# Altium schematic sheet synch_demod.SchDoc: Force Stage
size Tabloid; DocumentNumber: LM-002; Revision: F; SheetNumber: 1; SheetTotal: 2; DocumentName: LM-002; ProjectName: LM-002
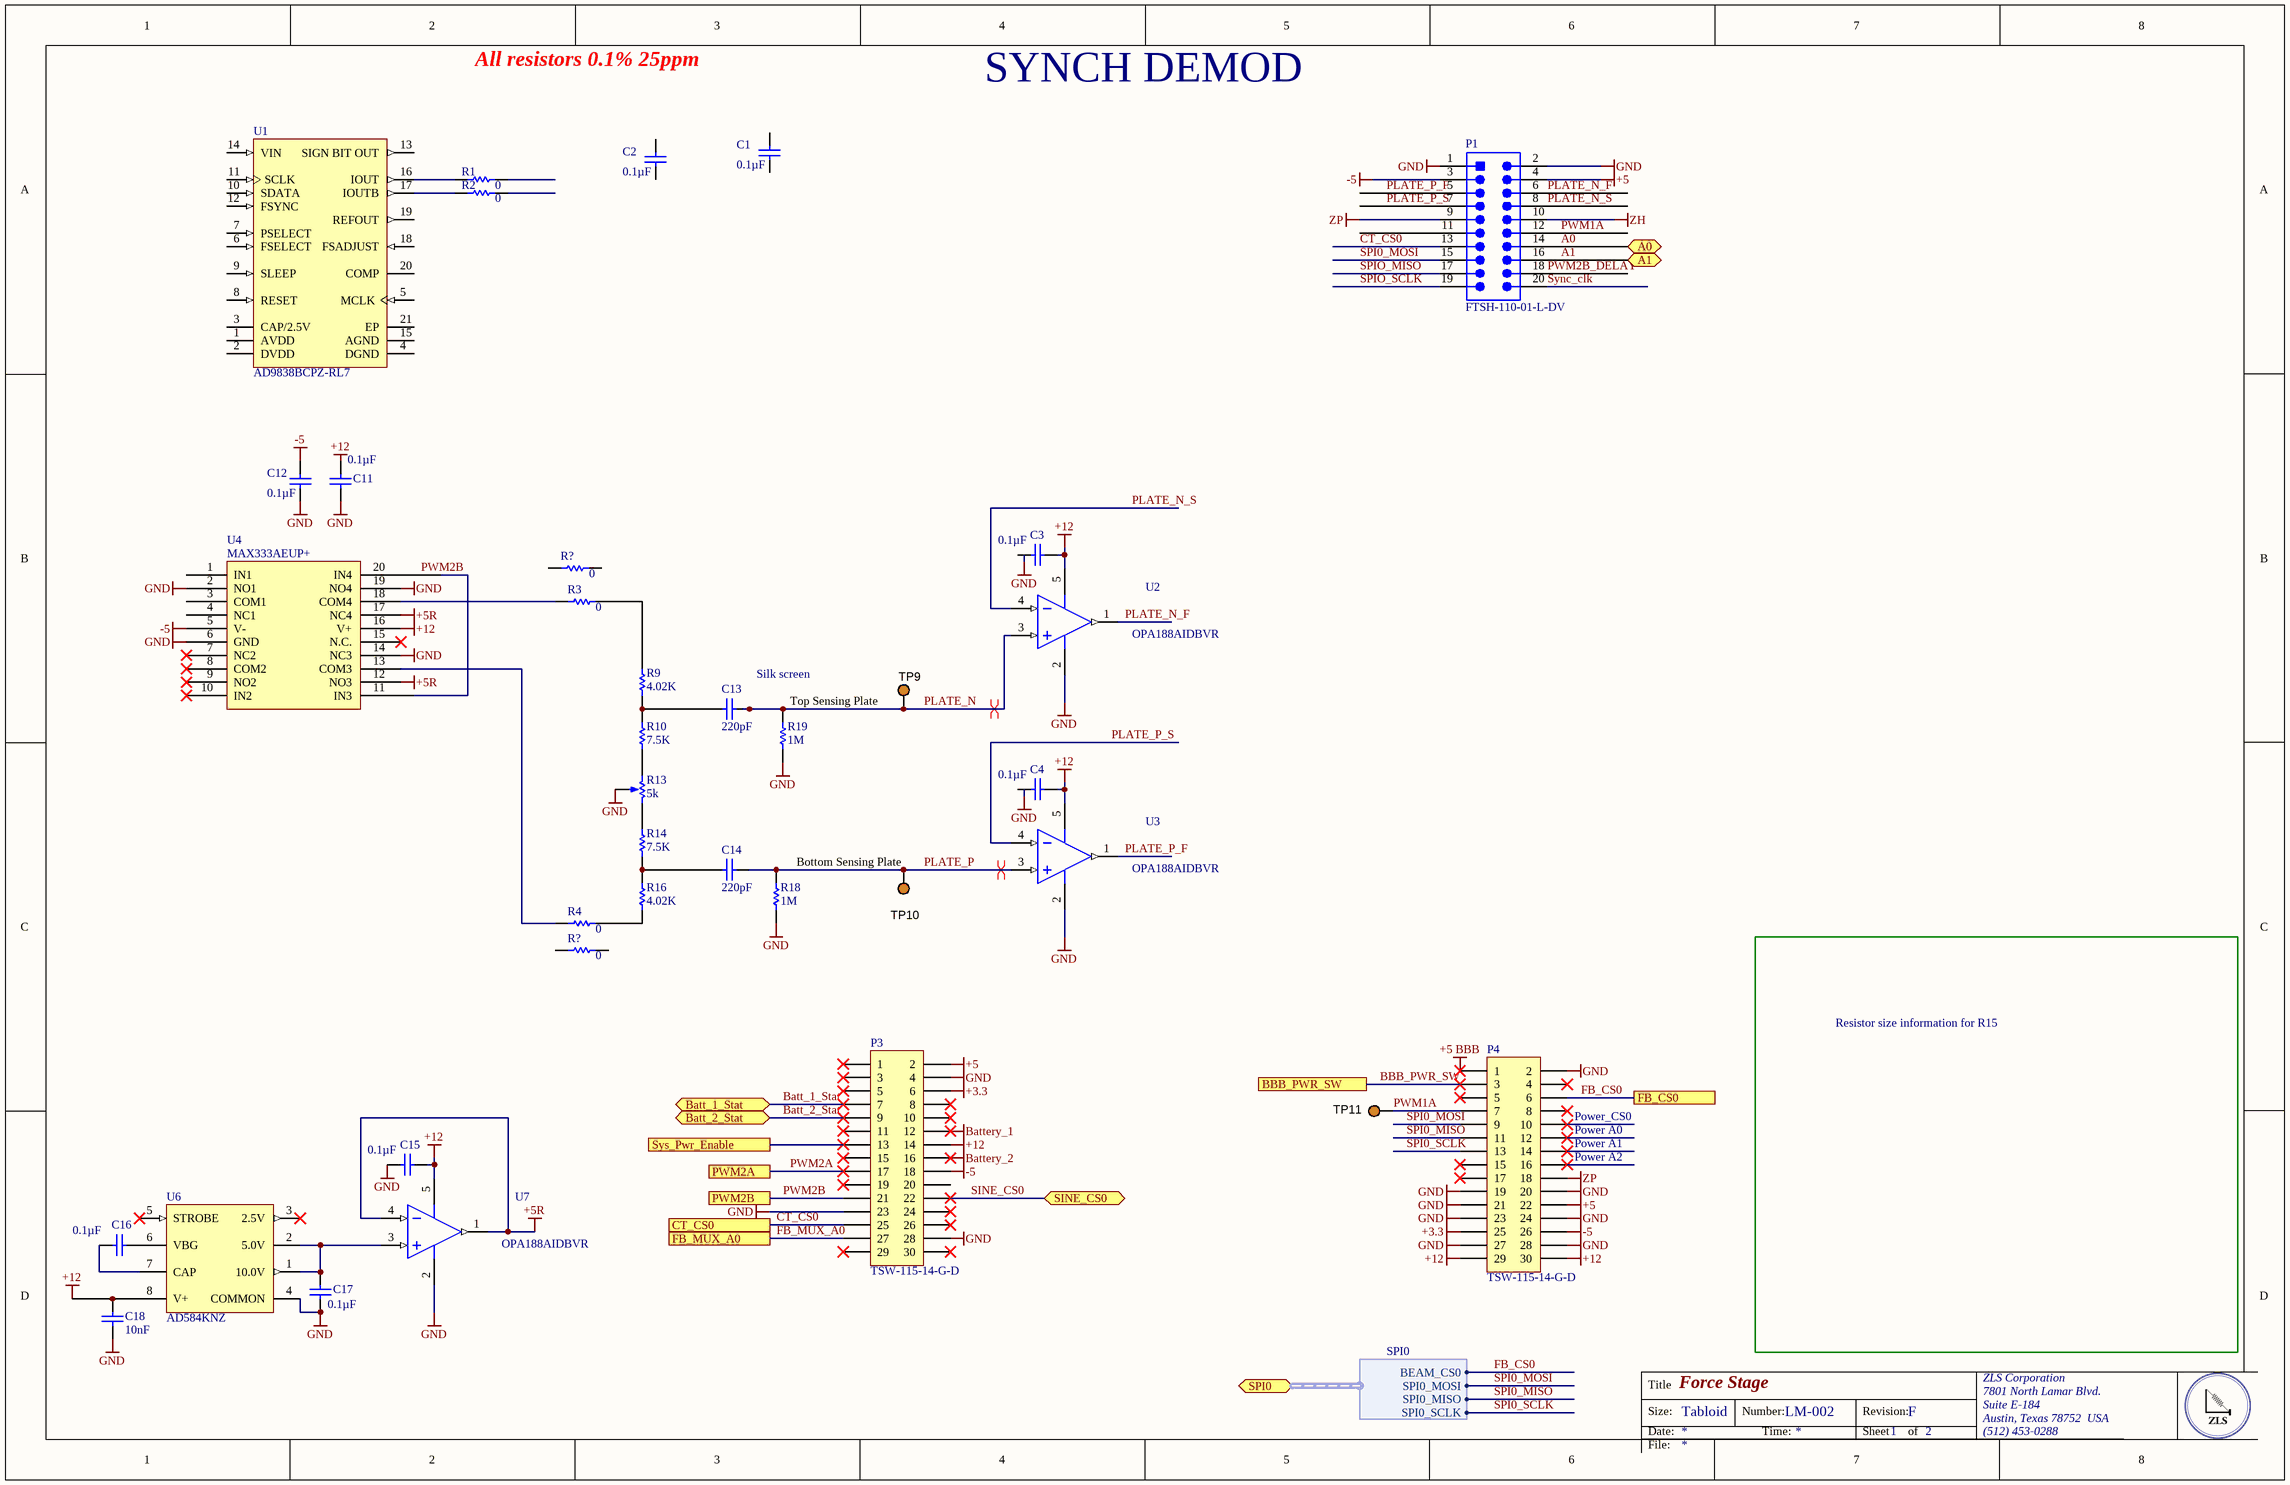
[diagram p0: synch_demod.SchDoc]

## Parts
(Parts that share a designator on the sheet are numbered #1, #2 ... from top to bottom, then left to right.)
C1  Capacitance: 0.1µF  [CAPC0805(2012)145_N]  (hidden comment: CAP CER 0.1UF 25V X7R 0805)
C2  Capacitance: 0.1µF  [CAPC0805(2012)145_N]  (hidden comment: CAP CER 0.1UF 25V X7R 0805)
C3  Capacitance: 0.1µF  [CAPC0805(2012)145_N]  (hidden comment: CAP CER 0.1UF 25V X7R 0805)
C4  Capacitance: 0.1µF  [CAPC0805(2012)145_N]  (hidden comment: CAP CER 0.1UF 25V X7R 0805)
C11  Capacitance: 0.1µF  [CAPC0805(2012)145_N]  (hidden comment: CAP CER 0.1UF 25V X7R 0805)
C12  Capacitance: 0.1µF  [CAPC0805(2012)145_N]  (hidden comment: CAP CER 0.1UF 25V X7R 0805)
C13  Capacitance: 220pF  [CAPC0805(2012)155_L]  (hidden comment: CAP CER 1UF 25V X7R 0805)
C14  Capacitance: 220pF  [CAPC0805(2012)155_L]  (hidden comment: CAP CER 1UF 25V X7R 0805)
C15  Capacitance: 0.1µF  [CAPC0805(2012)145_N]  (hidden comment: CAP CER 0.1UF 25V X7R 0805)
C16  Capacitance: 0.1µF  [CAPC0805(2012)145_N]  (hidden comment: CAP CER 0.1UF 25V X7R 0805)
C17  Capacitance: 0.1µF  [CAPC0805(2012)145_N]  (hidden comment: CAP CER 0.1UF 25V X7R 0805)
C18  Capacitance: 10nF  [CAPC0805(2012)145_N]  (hidden comment: Multilayer Ceramic Capacitors MLCC - SMD/SMT 0.01uF 50volts 10% X7R)
P1  FTSH-110-01-L-DV  [SMTC-FTSH-110-01-L-DV_V]
P3  TSW-115-14-G-D  [TSW-115-14-G-D]
P4  TSW-115-14-G-D  [TSW-115-14-G-D]
R1  0  [RESC0805(2012)_L]
R2  0  [RESC0805(2012)_L]
R3  0  [RESC0805(2012)_L]
R4  0  [RESC0805(2012)_L]
R9  4.02K  [RESC0805(2012)_L]
R10  7.5K  [RESC0805(2012)_L]
R13  Resistance (Ohms): 5k  [Trimmer 2.54]  (hidden comment: TRIMMER 5K OHM 0.25W PC PIN)
R14  7.5K  [RESC0805(2012)_L]
R16  4.02K  [RESC0805(2012)_L]
R18  1M  [RESC0805(2012)_L]
R19  1M  [RESC0805(2012)_L]
R?#1  0  [RESC0805(2012)_L]
R?#2  0  [RESC0805(2012)_L]
TP9  5003  [KSTN-5003]  (value not drawn)
TP10  5003  [KSTN-5003]  (value not drawn)
TP11  5003  [KSTN-5003]  (value not drawn)
U1  AD9838BCPZ-RL7  [ADI-CP-20-10_M]
U2  OPA188AIDBVR  [DBV0005A_M]
U3  OPA188AIDBVR  [DBV0005A_M]
U4  MAX333AEUP+  [TSOP65P640X90-20N]
U6  AD584KNZ  [ADI-N-8]
U7  OPA188AIDBVR  [DBV0005A_M]

## Ports
A0, A1, Batt_1_Stat, Batt_2_Stat, BBB_PWR_SW, CT_CS0, FB_CS0, FB_MUX_A0, PWM2A, PWM2B, SINE_CS0, SPI0 (harness SPI0), Sys_Pwr_Enable

## Harnesses
SPI0: BEAM_CS0, SPI0_MOSI, SPI0_MISO, SPI0_SCLK

## Nets
+3.3: P3.6 P4.25
+5: P1.4 P3.2 P4.22
+5 BBB: P4.1
+5R: U4.12(NO3) U4.17(NC4) U7.1(OUT) U7.4(IN-)
+12: C3.2 C4.2 C15.2 C18.1 P3.14 P4.29 P4.30 U2.5(V+) U3.5(V+) U4.16(V+) U6.8(V+) U7.5(V+)
-5: C12.1 P1.3 P3.18 P4.26 U4.5(V-)
Battery_1: P3.12
Battery_2: P3.16
GND: C11.2 C12.2 C15.1 C17.2 C18.2 P1.1 P1.2 P3.4 P3.23 P3.28 P4.2 P4.19 P4.20 P4.21 P4.23 P4.24 P4.27 P4.28 R13.2(b) R18.1 R19.1 U2.2(V-) U3.2(V-) U4.2(NO1) U4.6(GND) U4.14(NC3) U4.19(NO4) U6.4(COMMON) U7.2(V-)
ZH: P1.10
ZP: P1.9 P4.18
A0: P1.14 ; port A0
A1: P1.16 ; port A1
Batt_1_Stat: P3.7 ; port Batt_1_Stat
Batt_2_Stat: P3.9 ; port Batt_2_Stat
BBB_PWR_SW: P4.3 ; port BBB_PWR_SW
CT_CS0: P1.13 P3.25 ; port CT_CS0
FB_CS0: P4.6 ; port FB_CS0, port SPI0.BEAM_CS0
FB_MUX_A0: P3.27 ; port FB_MUX_A0
PLATE_N: C13.1 R19.2 TP9.1 U2.3(IN+)
PLATE_N_F: P1.6 U2.1(OUT)
PLATE_N_S: P1.8 U2.4(IN-)
PLATE_P: C14.2 R18.2 TP10.1 U3.3(IN+)
PLATE_P_F: P1.5 U3.1(OUT)
PLATE_P_S: P1.7 U3.4(IN-)
PWM1A: P1.12 P4.7 TP11.1
PWM2A: P3.17 ; port PWM2A
PWM2B: P3.21 U4.11(IN3) U4.20(IN4) ; port PWM2B
PWM2B_DELAY: P1.18
SINE_CS0: P3.22 ; port SINE_CS0
SPI0_MISO: P4.11 ; port SPI0.SPI0_MISO
SPI0_MOSI: P1.15 P4.9 ; port SPI0.SPI0_MOSI
SPI0_SCLK: P4.13 ; port SPI0.SPI0_SCLK
SPIO_MISO: P1.17
SPIO_SCLK: P1.19
Sync_clk: P1.20
Sys_Pwr_Enable: P3.13 ; port Sys_Pwr_Enable
NetC13_2: C13.2 R9.1 R10.2
NetC14_1: C14.1 R14.1 R16.2
NetC16_1: C16.1 U6.7(CAP)
NetC16_2: C16.2 U6.6(VBG)
NetC17_1: C17.1 U6.1(10.0V) U6.2(5.0V) U7.3(IN+)
NetR1_2: R1.2 U1.16(IOUT)
NetR2_2: R2.2 U1.17(IOUTB)
NetR3_1: R3.1 R9.2
NetR3_2: R3.2 U4.18(COM4)
NetR4_1: R4.1 R16.1
NetR4_2: R4.2 U4.13(COM3)
NetR10_1: R10.1 R13.1(a)
NetR13_3: R13.3(c) R14.2

Not connected (* = marked no-connect by the designer): C1 1 2; C2 1 2; C3 1; C4 1; C11 1; P1 11; P3 1* 3* 5* 8* 10* 11* 15* 19* 20 24* 26* 29* 30*; P4 4* 5* 8* 10* 12* 14* 15* 16* 17*; R1 1; R2 1; R?#1 1 2; R?#2 1 2; U1 1(AVDD) 2(DVDD) 3(CAP/2.5V) 4(DGND) 5(MCLK) 6(FSELECT) 7(PSELECT) 8(RESET) 9(SLEEP) 10(SDATA) 11(SCLK) 12(FSYNC) 13(SIGN_BIT_OUT) 14(VIN) 15(AGND) 18(FSADJUST) 19(REFOUT) 20(COMP) 21(EP); U4 1(IN1) 3(COM1) 4(NC1) 7(NC2)* 8(COM2)* 9(NO2)* 10(IN2)* 15(N.C.)*; U6 3(2.5V)* 5(STROBE)*

## Layout directives
differential pair: PLATE_N, PLATE_P

## Notes on the sheet
- All resistors 0.1% 25ppm
- SYNCH DEMOD
- Silk screen
- Top Sensing Plate
- (near TP10) Bottom Sensing Plate
- Resistor size information for R15
- (near P4) Power_CS0
- (near P4) Power A0
- (near P4) Power A1
- (near P4) Power A2
- Labels drawn without touching a wire or pin: +12
- Title
- Size:
- Date:
- Tabloid
- Number:
- Time:
- Revision:
- Sheet
- of
- ZLS Corporation
- 7801 North Lamar Blvd.
- Suite E-184
- Austin, Texas 78752  USA
- (512) 453-0288
- File:

## Library data of the parts
C1-C4 C11 C12 C15-C17 = CMP-1036-04795-1: Manufacturer: Murata Electronics North America; Manufacturer Part Number: GRM21BR71E104KA01L; Tolerance: ±10%; Supplier 1: Digi-Key; Supplier Part Number 1: 490-1673-6-ND; RoHS: RoHS Compliant; Category: Capacitors; Stock 1: 891652; Pricing 1: 1=0.2, 10=0.145, 100=0.0683, 500=0.04788, 1000=0.03964 (USD); Packaging: Digi-Reel®; Part Status: Active; Voltage - Rated: 25V; Temperature Coefficient: X7R; Operating Temperature: -55°C ~ 125°C; Features: -; Ratings: -; Applications: General Purpose; Mounting Type: Surface Mount, MLCC; Package / Case: 0805 (2012 Metric); Size / Dimension: 0.079" L x 0.049" W (2.00mm x 1.25mm); Height - Seated (Max): -; Thickness (Max): 0.053" (1.35mm); Lead Spacing: -; Lead Style: -; ComponentLink1URL: http://www.murata.com/~/media/webrenewal/support/library/catalog/products/capacitor/mlcc/c02e.ashx; ComponentLink1Description: http://www.murata.com/~/media/webrenewal/support/library/catalog/products/capacitor/mlcc/c02e.ashx
C13 C14 = CMP-1036-04882-1: Manufacturer: Murata Electronics North America; Manufacturer Part Number: GRM21BR71E105KA99L; Tolerance: ±10%; Supplier 1: Digi-Key; Supplier Part Number 1: 490-6484-6-ND; RoHS: RoHS Compliant; Category: Capacitors; Stock 1: 295074; Pricing 1: 1=0.14, 10=0.099, 100=0.0468, 500=0.0328, 1000=0.02715 (USD); Packaging: Digi-Reel®; Part Status: Active; Voltage - Rated: 25V; Temperature Coefficient: X7R; Operating Temperature: -55°C ~ 125°C; Features: -; Ratings: -; Applications: General Purpose; Mounting Type: Surface Mount, MLCC; Package / Case: 0805 (2012 Metric); Size / Dimension: 0.079" L x 0.049" W (2.00mm x 1.25mm); Height - Seated (Max): -; Thickness (Max): 0.053" (1.35mm); Lead Spacing: -; Lead Style: -; ComponentLink1URL: http://www.murata.com/~/media/webrenewal/support/library/catalog/products/capacitor/mlcc/c02e.ashx; ComponentLink1Description: http://www.murata.com/~/media/webrenewal/support/library/catalog/products/capacitor/mlcc/c02e.ashx
C18 = CMP-1036-04795-1: Manufacturer: Kemet; Manufacturer Part Number: C0805C103K5RACAUTO; Voltage Rating: 50V; Supplier 1: Digi-Key; Supplier Part Number 1: 399-6924-1-ND; Stock 1: 63236; Pricing 1: 1=0.12, 10=0.087, 100=0.041, 500=0.0287, 1000=0.0238 (USD); Mount: Surface Mount; Case/Package: 0805; Case Code (Metric): 2012; Case Code (Imperial): 0805; Dielectric Material: Ceramic; Contact Plating: Tin; Min Operating Temperature: -55°C; Max Operating Temperature: 125°C; Tolerance: 10%; Packaging: Tape and Reel; Package Quantity: 1; Voltage Rating (DC): 50V; Dielectric: X7R; Termination: SMD/SMT; Length: 2mm; Height: 0.78mm; Width: 0.049inch; Thickness: 0.035inch; Depth: 1.25mm; Radiation Hardening: No; REACH SVHC: No SVHC; ComponentLink1URL: https://datasheet.ciiva.com/22700/1693454-22700519.pdf; ComponentLink1Description: https://datasheet.ciiva.com/22700/1693454-22700519.pdf; ComponentLink2URL: https://datasheet.ciiva.com/7842/1693454-7842175.pdf; ComponentLink2Description: https://datasheet.ciiva.com/7842/1693454-7842175.pdf
P1 = CMP-2000-06294-2: Male Header, Pitch 1.27 mm, 2 x 10 Position, Height 6.1 mm, -55 to 125 degC, RoHS, Tube; Manufacturer: Samtec; Online Catalog: FTSHSeries; Number of Positions Loaded: All; Connector Type: Header,Unshrouded; Product Training Modules: Board-to-BoardConnectors; Featured Product: Board-To-BoardInterconnectSystems; Other Names: SAM1161-10; EDA / CAD Models: DownloadfromAcceleratedDesigns; Number of Positions: 20; Catalog Drawings: FTSHSeriesFTSHSeriesSMTSide; Package Reference: FTSH-110-01-L-DV; Family: RectangularConnectors-Headers,MalePins; Mounting Technology: SurfaceMount; Contact Type: MalePin; Manufacturer URL: http://www.samtec.com/; Package URL: http://suddendocs.samtec.com/prints/ftsh-1xx-xx-xxx-dv-xxx-xxx-mkt.pdf; Package Description: Male Header, Pitch 1.27 mm, 2 x 10 Position, Height 6.1 mm; Packaging: Bulk; Termination: Solder; Category: Connectors,Interconnects; Fastening Type: -; Datasheet Version: F-215 , 02/2016; Contact Finish Thickness: 10µin(0.25µm); Number of Rows: 2; Datasheet URL: http://suddendocs.samtec.com/catalog_english/ftsh_smt.pdf; Mounting Type: SurfaceMount; Series: FTSH; Features: -; Contact Finish: Gold; Standard Package: 1; Color: Black
P3 P4 = Header 15X2: Header, 15-Pin, Dual row; Manufacturer: Samtec Inc.; Pitch - Mating: 0.100" (2.54mm); Number of Positions: 30; Number of Positions Loaded: All; Style: Board to Board or Cable; Shrouding: Unshrouded; Contact Length - Mating: 0.320" (8.13mm); Contact Length - Post: 0.110" (2.79mm); Overall Contact Length: 0.530" (13.46mm); Material Flammability Rating: UL94 V-0; Supplier 1: Digi-Key; Supplier Part Number 1: SAM1052-15-ND; Manufacturer Part Number: TSW-115-14-G-D; RoHS: RoHS Compliant; Category: Connectors, Interconnects; Stock 1: 0; Pricing 1: 1=3.69, 10=3.3, 100=2.7176, 500=2.1482, 1000=1.84409, 5000=1.68233, 10000=1.61763 (USD); Packaging: Bulk; Part Status: Active; Connector Type: Header; Contact Type: Male Pin; Number of Rows: 2; Row Spacing - Mating: 0.100" (2.54mm); Mounting Type: Through Hole; Termination: Solder; Fastening Type: Push-Pull; Insulation Height: 0.100" (2.54mm); Contact Shape: Square; Contact Finish - Mating: Gold; Contact Finish Thickness - Mating: 10.0µin (0.25µm); Contact Finish - Post: Gold; Contact Material: Phosphor Bronze; Insulation Material: Polybutylene Terephthalate (PBT); Features: -; Operating Temperature: -55°C ~ 125°C; Ingress Protection: -; Insulation Color: Black; Current Rating: -; Voltage Rating: -; Mated Stacking Heights: -; Contact Finish Thickness - Post: 3.00µin (0.076µm); Applications: -; ComponentLink1URL: http://suddendocs.samtec.com/prints/tsw-xxx-xx-xxx-x-xx-xxx-mkt.pdf; ComponentLink1Description: http://suddendocs.samtec.com/prints/tsw-xxx-xx-xxx-x-xx-xxx-mkt.pdf
R1-R4 R?#1 R?#2 = CMP-1013-00215-1: RES SMD 0 OHM JUMPER 1/8W 0805; Manufacturer: Panasonic Electronic Components; Manufacturer Part Number: ERJ-6GEY0R00V; Power (Watts): 0.125W, 1/8W; Supplier 1: Digi-Key; Supplier Part Number 1: P0.0ACT-ND; RoHS: RoHS Compliant; Category: Resistors; Stock 1: 3414819; Pricing 1: 1=0.1, 10=0.074, 25=0.0532, 50=0.0406, 100=0.03, 250=0.02288, 500=0.0183, 1000=0.01347 (USD); Packaging: Cut Tape (CT); Part Status: Active; Tolerance: Jumper; Composition: Thick Film; Features: Automotive AEC-Q200; Temperature Coefficient: -; Operating Temperature: -55°C ~ 155°C; Package / Case: 0805 (2012 Metric); Supplier Device Package: 0805; Size / Dimension: 0.079" L x 0.049" W (2.00mm x 1.25mm); Height - Seated (Max): 0.028" (0.70mm); Failure Rate: -; ComponentLink1URL: http://industrial.panasonic.com/www-cgi/jvcr13pz.cgi?E+PZ+3+AOA0001+ERJ6GEY0R00V+7+WW; ComponentLink1Description: http://industrial.panasonic.com/www-cgi/jvcr13pz.cgi?E+PZ+3+AOA0001+ERJ6GEY0R00V+7+WW
R9 R16 = CMP-1013-00215-1: RES SMD 4.02K OHM 1% 1/8W 0805; Manufacturer: Vishay Dale; Manufacturer Part Number: CRCW08054K02FKEAHP; Power (Watts): 0.5W, 1/2W; Temperature Coefficient: ±100ppm/°C; Supplier 1: Digi-Key; Supplier Part Number 1: 541-4.02KTCT-ND; RoHS: RoHS Compliant; Category: Resistors; Stock 1: 2935; Pricing 1: 1=0.28, 10=0.233, 100=0.0911, 1000=0.03812, 2500=0.03494 (USD); Packaging: Cut Tape (CT); Part Status: Active; Tolerance: ±1%; Composition: Thick Film; Features: Automotive AEC-Q200, Pulse Withstanding; Operating Temperature: -55°C ~ 155°C; Package / Case: 0805 (2012 Metric); Supplier Device Package: 0805; Size / Dimension: 0.079" L x 0.049" W (2.00mm x 1.25mm); Height - Seated (Max): 0.020" (0.50mm); Failure Rate: -; ComponentLink1URL: http://www.vishay.com/docs/20043/crcwhpe3.pdf; ComponentLink1Description: http://www.vishay.com/docs/20043/crcwhpe3.pdf
R10 R14 = CMP-1013-00215-1: RES SMD 7.5K OHM 1% 1/8W 0805; Manufacturer: Vishay Dale; Manufacturer Part Number: CRCW08057K50FKEA; Power (Watts): 0.125W, 1/8W; Temperature Coefficient: ±100ppm/°C; Supplier 1: Digi-Key; Supplier Part Number 1: 541-7.50KCCT-ND; RoHS: RoHS Compliant; Category: Resistors; Stock 1: 2093; Pricing 1: 1=0.1, 10=0.055, 100=0.0223, 1000=0.01003, 2500=0.0087 (USD); Packaging: Cut Tape (CT); Part Status: Active; Tolerance: ±1%; Composition: Thick Film; Features: Automotive AEC-Q200; Operating Temperature: -55°C ~ 155°C; Package / Case: 0805 (2012 Metric); Supplier Device Package: 0805; Size / Dimension: 0.079" L x 0.049" W (2.00mm x 1.25mm); Height - Seated (Max): 0.020" (0.50mm); Failure Rate: -; ComponentLink1URL: http://www.vishay.com/docs/20035/dcrcwe3.pdf; ComponentLink1Description: http://www.vishay.com/docs/20035/dcrcwe3.pdf
R13 = Trimmer: Manufacturer: Vishay Foil Resistors (Division of Vishay Precision Group); Manufacturer Part Number: Y00535K00000J0L; Power (Watts): 0.25W, 1/4W; Tolerance: ±5%; Temperature Coefficient: ±10ppm/°C; Number of Turns: 21; Adjustment Type: Side Adjustment; Resistive Material: Metal Foil; Supplier 1: Digi-Key; Supplier Part Number 1: 804-1020-ND; RoHS: RoHS Compliant; Category: Potentiometers, Variable Resistors; Stock 1: 679; Pricing 1: 1=34.42, 10=32.265, 25=26.5292, 50=22.944, 100=22.227, 250=20.793, 500=19.2156 (USD); Packaging: Bulk; Part Status: Active; Mounting Type: Through Hole; Termination Style: PC Pins; Size / Dimension: Rectangular - 0.250" x 0.175" Face x 0.250" L (6.35mm x 4.45mm x 6.35mm); ComponentLink1URL: http://www.vishaypg.com/docs/63053/1240.pdf; ComponentLink1Description: http://www.vishaypg.com/docs/63053/1240.pdf
R18 R19 = CMP-1013-00215-1: RES SMD 1M OHM 1% 1/8W 0805; Manufacturer: Vishay Dale; Manufacturer Part Number: RCV08051M00FKEA; Power (Watts): 0.125W, 1/8W; Temperature Coefficient: ±100ppm/°C; Supplier 1: Digi-Key; Supplier Part Number 1: BC2810CT-ND; RoHS: RoHS Compliant; Category: Resistors; Stock 1: 15942; Pricing 1: 1=0.31, 10=0.266, 100=0.1041, 1000=0.04356, 2500=0.03993 (USD); Packaging: Cut Tape (CT); Part Status: Active; Tolerance: ±1%; Composition: Thick Film; Features: High Voltage; Operating Temperature: -55°C ~ 155°C; Package / Case: 0805 (2012 Metric); Supplier Device Package: 0805; Size / Dimension: 0.079" L x 0.049" W (2.00mm x 1.25mm); Height - Seated (Max): 0.020" (0.50mm); Failure Rate: -; ComponentLink1URL: http://www.vishay.com/docs/20054/rcve3.pdf; ComponentLink1Description: http://www.vishay.com/docs/20054/rcve3.pdf
TP9-TP11 = CMP-1672-00009-1: Test Point, Orange, 1-Pin THD, RoHS; Peak Reverse Current: 600 uA; Forward Current: 3 A; Max Surge Current: 80 A; Forward Voltage: 1.08 V; Max Operating Temperature: 150 degC; PackageReference: 5003; Pins: 2; ComponentLink2URL: http://keyelco.com/userAssets/file/M65p56.pdf; PackageDescription: 1-Pin Through Hole Device, Dia 2.54 mm; Weight: 0.01 lb; Diameter: 5.3 mm; Mount: Through Hole; Package Quantity: 500; Packaging: Bulk; Min Operating Temperature: -65 degC; ComponentLink1Description: Manufacturer URL; Height: 0.25 inch; ComponentLink1URL: http://www.keyelco.com/; ComponentLink2Description: Datasheet; Width: 0.25 inch; REACH SVHC: No SVHC; RoHSCompliant: true; Radiation Hardening: No; Length: 9.5 mm; DatasheetVersion: Jun-15
U1 = CMP-0293-00002-1: 11 mW Power, 2.3 V to 5.5 V,Complete DDS, CP-20-10, 1500 Reel, Pb-Free; Tuning Word Width (bits): 28bit; REFCLK Multiplier: Yes; Master fclk: 16MHz; FS Iout (mA nom): 3mA; I/O Interface: Serial; Resolution (Bits): 10bit; Compliance Range (V): 800mV; ComponentLink1Description: Manufacturer URL; ComponentLink2Description: Datasheet; ComponentLink3URL: http://www.analog.com/static/imported-files/packages/PKG_PDF/LFCSP(CP)/CP_20_10.pdf; PackageVersion: 061609-B; PackageDescription: 20-Lead Lead Frame Chip Scale Package [LFCSP_WQ]; Code_JEDEC: MO-220-WGGD; ComponentLink3Description: Package Specification; DatasheetVersion: Rev. A; PackageReference: CP-20-10; ComponentLink2URL: http://www.analog.com/static/imported-files/data_sheets/AD9838.pdf; ComponentLink1URL: www.analog.com
U2 U3 U7 = CMP-0809-00005-2: Precision, Low Noise, Rail-to-Rail Output, Zero-Drift Operational Amplifier, 4 to 36 V, -40 to 125 degC, 5-pin SOT23 (DBV5), Green (RoHS & no Sb/Br); Manufacturer: Texas Instruments; Total Supply Voltage(Min)(+5V is 5, +/-5V is 10): 4; Offset Drift(Typ)(uV/C): 0.03; Rating: Catalog; SubFamily: Zero Drift Precision Amplifier; GBW(Typ)(MHz): 2; Slew Rate(Typ)(V/us): 0.8; Number of Channels: 1; CMRR(Min)(dB): 120; Iq per channel(Max)(mA): 0.51; Total Supply Voltage(Max)(+5V is 5, +/-5V is 10): 36; PartNumber: OPA188AIDBVR; ComponentLink2Description: Datasheet; ComponentLink2URL: http://www.ti.com/lit/ds/symlink/opa188.pdf; ComponentLink1Description: Manufacturer URL; Mounting Technology: Surface Mount; Eco-Plan: Green (RoHS & no Sb/Br); ComponentLink1URL: http://www.ti.com/; PackageVersion: 4073253-4/K, 03/2006; DatasheetVersion: SBOS642A; ComponentLink3Description: Package Specification; PackageReference: DBV0005A; ComponentLink3URL: http://www.ti.com/litv/pdf/mpds018i; PackageDescription: 5-Pin Plastic Small Outline, Body 1.6 x 2.9 mm, Pitch 0.95 mm; Code_JEDEC: MO-178
U4 = MAX333CWP+: IC SWITCH QUAD SPDT 20TSSOP; Manufacturer: Maxim Integrated; Multiplexer/Demultiplexer Circuit: 2:1; On-State Resistance (Max): 45 Ohm; Channel-to-Channel Matching (&Delta;Ron): 2 Ohm (Max); Voltage - Supply, Single (V+): 10 V ~ 30 V; Voltage - Supply, Dual (V±): ±4.5 V ~ 20 V; Switch Time (Ton, Toff) (Max): 175ns, 145ns; Charge Injection: 2pC; Channel Capacitance (CS(off), CD(off)): 5pF; Current - Leakage (IS(off)) (Max): 250pA; Crosstalk: -78dB @ 1MHz; Supplier 1: Digi-Key; Supplier Part Number 1: MAX333AEUP+-ND; Manufacturer Part Number: MAX333AEUP+; RoHS: RoHS Compliant; Category: Integrated Circuits (ICs); Stock 1: 1328; Pricing 1: 1=6.77, 10=6.432, 25=6, 50=5.8942 (USD); Packaging: Tube; Part Status: Active; Switch Circuit: SPDT; -3db Bandwidth: -; Operating Temperature: -40°C ~ 85°C (TA); Package / Case: 20-TSSOP (0.173", 4.40mm Width); Supplier Device Package: 20-TSSOP; Base Part Number: MAX333; ComponentLink1URL: https://pdfserv.maximintegrated.com/en/ds/MAX333A.pdf; ComponentLink1Description: https://pdfserv.maximintegrated.com/en/ds/MAX333A.pdf
U6 = CMP-0784-00054-1: Pin Programmable, Precision Voltage Reference, + 2.5 / + 5 / + 7.5 / + 10 Prog V Output, 4.5 to 30 V Supply, Commercial, 8-pin DIP (N-8), Tube; Manufacturer: Analog Devices; Max V Supply (V): 30; Min V Supply (V): 4.5; Ref Out TC (ppm/C): 15; Vout: 2.5V, 5V, 7.5V, 10V; ComponentLink3URL: http:/www.analog.com/static/imported-files/packages/PKG_PDF/PDIP(N)/N_8.pdf; ComponentLink1URL: http://www.analog.com/en/index.html; PartNumber: AD584KNZ; ComponentLink1Description: Manufacturer URL; ComponentLink2Description: Datasheet; PackageDescription: 8-Pin Plastic Dual In-Line Package, Row spacing 7.62 mm, Pitch 2.54 mm; Operating Temp Range: 0 to 70 degC; DatasheetVersion: Rev. C; Code_JEDEC: MS-001; Packing: Tube; ComponentLink3Description: Package Specification; PackageReference: N-8; ComponentLink4Description: URL Link1; Mounting Technology: Through Hole; PackageVersion: 070606-A, 07/2006; ComponentLink4URL: Product URL:http://www.analog.com/en/special-linear-functions/voltage-references/ad584/products/product.html; ComponentLink2URL: http://www.analog.com/static/imported-files/data_sheets/AD584.pdf